# EAGLE schematic TSat0-AvionicsPCB_v12 (EAGLE 9.7.0)
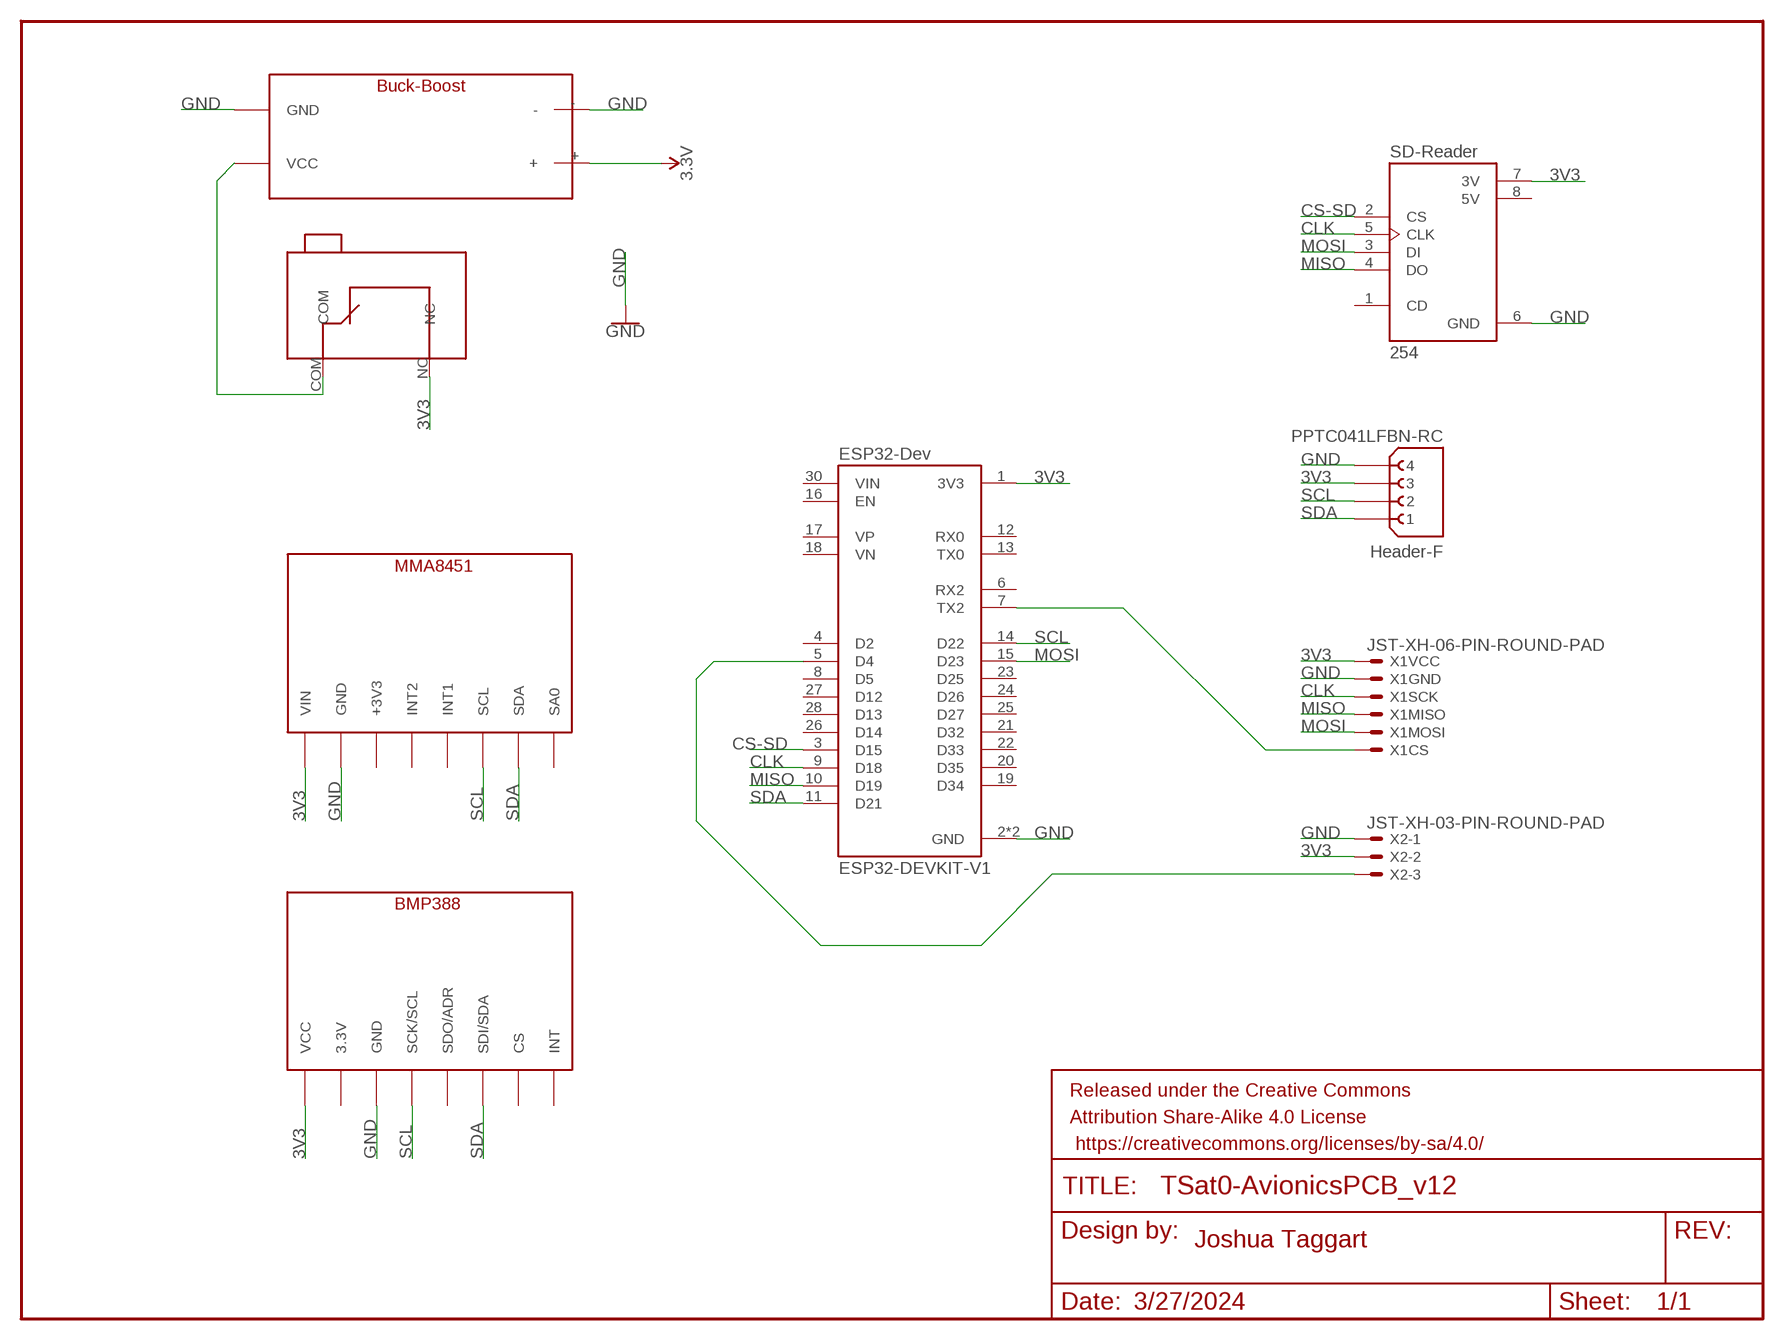
[diagram p0: schematic, sheet 1]

## Parts
BMP388  BMP388  [BMP388-FP]
FRAME1  FRAME-LETTERNO_PACKAGE  [DUMMY]
J1  PPTC041LFBN-RC  [SULLINS_PPTC041LFBN-RC]
MMA8451  MMA8451  [MMA8451-FP]
U1  ESP32-DEVKIT-V1  [MODULE_ESP32_DEVKIT_V1]
U2  254  [MODULE_254]
U$1  BUCKBOOST-LIPO  [BUCKBOOST-FP]
U$2  OMRON-MICROSWITCH  [OMRON-MICROSWITCH-FP]
X1  JST-XH-06-PIN-ROUND-PAD  [JST-XH-06-PACKAGE-ROUND-PAD]
X2  JST-XH-03-PIN-ROUND-PAD  [JST-XH-03-PACKAGE-ROUND-PAD]

## Nets
3.3V: U$1.+
3V3: BMP388.VCC J1.3 MMA8451.VIN U1.1(3V3) U2.7(3V) U$2.NC X1.VCC X2.2
CLK: U1.9(D18) U2.5(CLK) X1.SCK
CS-SD: U1.3(D15) U2.2(CS)
GND: BMP388.GND J1.4 MMA8451.GND U1.2(GND) U1.29(GND) U2.6(GND) U$1.- U$1.GND X1.GND X2.1
MISO: U1.10(D19) U2.4(DO) X1.MISO
MOSI: U1.15(D23) U2.3(DI) X1.MOSI
N$1: U1.7(TX2) X1.CS
N$2: U$1.VCC U$2.COM
N$3: U1.5(D4) X2.3
SCL: BMP388.SCK/SCL J1.2 MMA8451.SCL U1.14(D22)
SDA: BMP388.SDI/SDA J1.1 MMA8451.SDA U1.11(D21)
Unconnected: BMP388.3.3V BMP388.CS BMP388.INT BMP388.SDO/ADR MMA8451.+3V3 MMA8451.INT1 MMA8451.INT2 MMA8451.SA0 U1.4(D2) U1.6(RX2) U1.8(D5) U1.12(RX0) U1.13(TX0) U1.16(EN) U1.17(VP) U1.18(VN) U1.19(D34) U1.20(D35) U1.21(D32) U1.22(D33) U1.23(D25) U1.24(D26) U1.25(D27) U1.26(D14) U1.27(D12) U1.28(D13) U1.30(VIN) U2.1(CD)

## Notes on the sheet
- Joshua Taggart
- 3/27/2024

## Power pins joined to a net without a drawn wire
5V: U2.8(5V)

## Library data of the parts
BMP388 = TSat0-Library:BMP388
FRAME1 = SparkFun-Aesthetics:FRAME-LETTER: Schematic Frame - Letter Standard 8.5x11 US Letter frame; DESIGNER: Nobody; VERSION: v01
J1 = TSat0-Library:PPTC041LFBN-RC: 4 Position Header Connector Through Hole Check availability <https://pricing.snapeda.com/parts/PPTC041LFBN-RC/Sullins%20Connector/view-part?ref=eda>; AVAILABILITY: In Stock; CHECK_PRICES: https://www.snapeda.com/parts/PPTC041LFBN-RC/Sullins+Connector+Solutions/view-part/?ref=eda; DESCRIPTION: 4 Position Header Connector 0.100 (2.54mm) Through Hole Tin; MF: Sullins Connector; MP: PPTC041LFBN-RC; PACKAGE: None; PRICE: None; SNAPEDA_LINK: https://www.snapeda.com/parts/PPTC041LFBN-RC/Sullins+Connector+Solutions/view-part/?ref=snap
MMA8451 = TSat0-Library:MMA8451
U1 = TSat0-Library:ESP32-DEVKIT-V1: Dual core, Wi-Fi: 2.4 GHz up to 150 Mbits/s,BLE (Bluetooth Low Energy) and legacy Bluetooth, 32 bits, Up to 240 MHz Check availability <https://pricing.snapeda.com/parts/ESP32-DEVKIT-V1/Do%20it/view-part?ref=eda>; AVAILABILITY: Not in stock; CHECK_PRICES: https://www.snapeda.com/parts/ESP32-DEVKIT-V1/Do+it/view-part/?ref=eda; DESCRIPTION: Dual core, Wi-Fi: 2.4 GHz up to 150 Mbits/s,BLE (Bluetooth Low Energy) and legacy Bluetooth, 32 bits, Up to 240 MHz; MF: Do it; MP: ESP32-DEVKIT-V1; PACKAGE: None; PRICE: None; SNAPEDA_LINK: https://www.snapeda.com/parts/ESP32-DEVKIT-V1/Do+it/view-part/?ref=snap
U2 = TSat0-Library:254: Check availability <https://pricing.snapeda.com/parts/254/Adafruit/view-part?ref=eda>; AVAILABILITY: In Stock; CHECK_PRICES: https://www.snapeda.com/parts/254/Adafruit+Industries/view-part/?ref=eda; DESCRIPTION: MicroSD card breakout board+ | Adafruit Industries 254; MF: Adafruit; MP: 254; PACKAGE: NON STANDARD Adafruit; PRICE: None; PURCHASE-URL: https://www.snapeda.com/api/url_track_click_mouser/?unipart_id=4653161&manufacturer=Adafruit&part_name=254&search_term=None; SNAPEDA_LINK: https://www.snapeda.com/parts/254/Adafruit+Industries/view-part/?ref=snap
U$1 = TSat0-Library:BUCKBOOST-LIPO
U$2 = TSat0-Library:OMRON-MICROSWITCH
X1 = TSat0-Library:JST-XH-06-PIN: JST XH Connector 2 Pin Wire to board connector. Pitch: 2,54 mm, (0.100") Number of pins: 6 Created by Rembrandt Electronics www.rembrandtelectronics.com
X2 = Rembrandt Electronics - JST XH Connectors v1-0:JST-XH-03-PIN: JST XH Connector 2 Pin Wire to board connector. Pitch: 2,54 mm, (0.100") Number of pins: 3 Created by Rembrandt Electronics www.rembrandtelectronics.com

## Net classes
0 default: width 0.254 mm